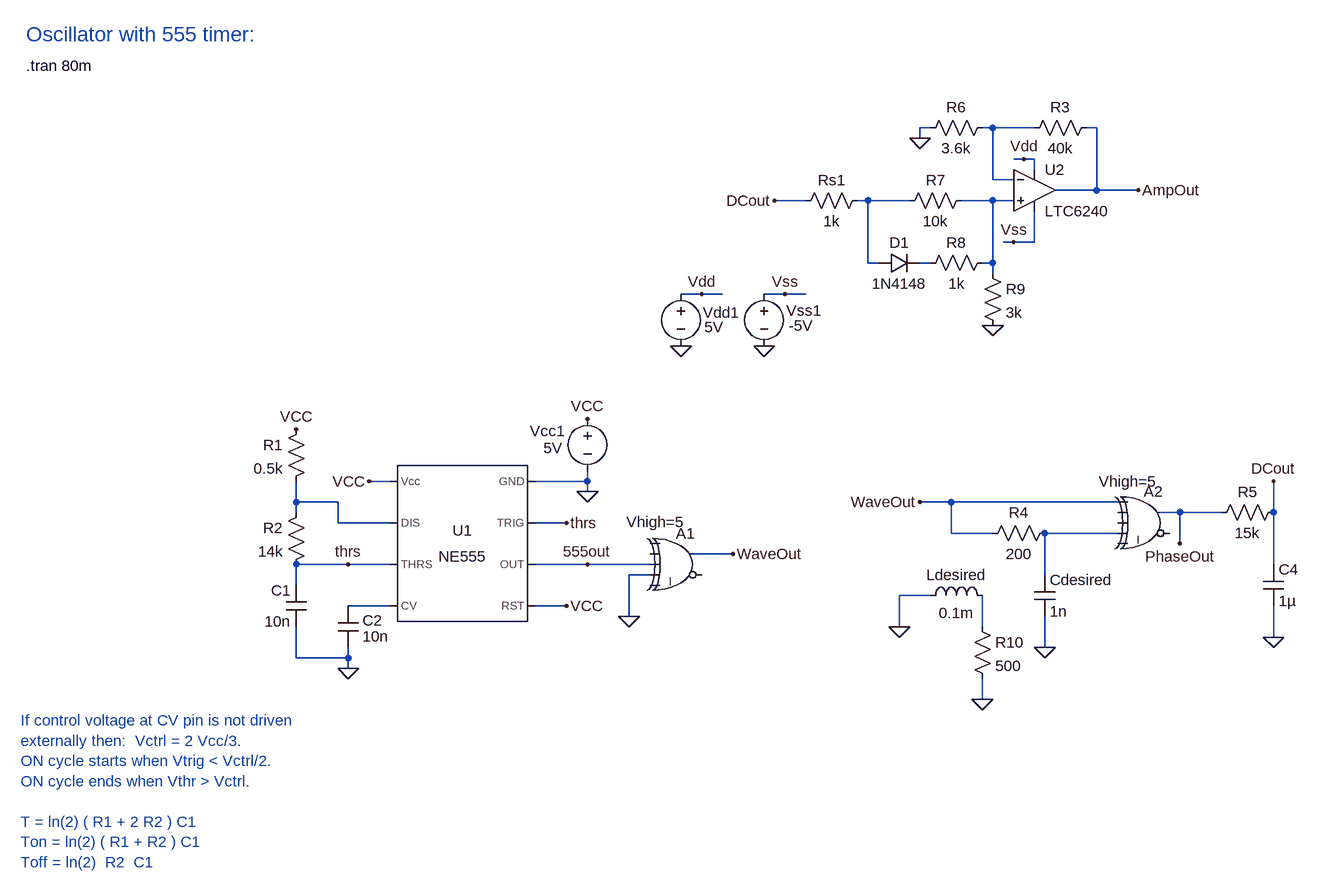
[diagram p0: schematic lcmeter_general.asc]
lcmeter_general.asc, the LTspice schematic file:
Version 4
SHEET 1 1228 680
WIRE 240 -720 224 -720
WIRE 336 -720 320 -720
WIRE 400 -720 336 -720
WIRE 496 -720 480 -720
WIRE 224 -704 224 -720
WIRE 384 -672 368 -672
WIRE 400 -672 384 -672
WIRE 400 -656 400 -672
WIRE 336 -640 336 -720
WIRE 368 -640 336 -640
WIRE 496 -624 496 -720
WIRE 496 -624 432 -624
WIRE 560 -624 496 -624
WIRE 48 -608 0 -608
WIRE 144 -608 128 -608
WIRE 208 -608 144 -608
WIRE 336 -608 288 -608
WIRE 368 -608 336 -608
WIRE 368 -544 352 -544
WIRE 400 -544 400 -592
WIRE 400 -544 368 -544
WIRE 144 -512 144 -608
WIRE 160 -512 144 -512
WIRE 240 -512 224 -512
WIRE 336 -512 336 -608
WIRE 336 -512 320 -512
WIRE 336 -496 336 -512
WIRE -112 -464 -144 -464
WIRE -80 -464 -112 -464
WIRE 16 -464 -16 -464
WIRE 48 -464 16 -464
WIRE -592 -176 -624 -176
WIRE -288 -176 -288 -192
WIRE -288 -176 -368 -176
WIRE -288 -160 -288 -176
WIRE -736 -144 -736 -176
WIRE -672 -144 -736 -144
WIRE 272 -144 224 -144
WIRE 528 -144 272 -144
WIRE -736 -128 -736 -144
WIRE 624 -128 592 -128
WIRE 688 -128 624 -128
WIRE 768 -128 768 -176
WIRE -672 -112 -672 -144
WIRE -592 -112 -672 -112
WIRE -320 -112 -368 -112
WIRE 272 -96 272 -144
WIRE 336 -96 272 -96
WIRE 528 -96 416 -96
WIRE 624 -80 624 -128
WIRE -64 -64 -128 -64
WIRE -656 -48 -736 -48
WIRE -592 -48 -656 -48
WIRE -288 -48 -368 -48
WIRE -192 -48 -288 -48
WIRE 768 -48 768 -128
WIRE -192 -32 -224 -32
WIRE 416 -32 416 -96
WIRE -736 -16 -736 -48
WIRE 240 0 192 0
WIRE -592 16 -656 16
WIRE -320 16 -368 16
WIRE -224 32 -224 -32
WIRE 192 48 192 0
WIRE 320 48 320 0
WIRE 768 64 768 16
WIRE 416 80 416 32
WIRE -736 96 -736 48
WIRE -656 96 -656 80
WIRE -656 96 -736 96
WIRE -656 112 -656 96
WIRE 320 160 320 128
FLAG -288 -160 0
FLAG -288 -48 555out
FLAG -656 112 0
FLAG -224 32 0
FLAG 416 80 0
FLAG 624 -80 PhaseOut
FLAG -288 -272 VCC
FLAG -320 16 VCC
FLAG -624 -176 VCC
FLAG -736 -256 VCC
FLAG -320 -112 thrs
FLAG -656 -48 thrs
FLAG 768 64 0
FLAG -64 -64 WaveOut
FLAG 224 -144 WaveOut
FLAG 768 -176 DCout
FLAG -144 -384 0
FLAG -112 -464 Vdd
FLAG 560 -624 AmpOut
FLAG 384 -672 Vdd
FLAG 336 -416 0
FLAG 224 -704 0
FLAG -16 -384 0
FLAG 16 -464 Vss
FLAG 368 -544 Vss
FLAG 0 -608 DCout
FLAG 320 160 0
FLAG 192 48 0
SYMBOL Misc\\NE555 -480 -80 M0
SYMATTR InstName U1
SYMBOL voltage -288 -288 M0
WINDOW 0 35 35 Left 2
WINDOW 3 38 61 Left 2
WINDOW 123 0 0 Left 2
WINDOW 39 0 0 Left 2
SYMATTR InstName Vcc1
SYMATTR Value 5V
SYMBOL cap -672 16 R0
WINDOW 0 38 22 Left 2
WINDOW 3 38 47 Left 2
SYMATTR InstName C2
SYMATTR Value 10n
SYMBOL Digital\\xor -144 -112 R0
WINDOW 3 -84 -1 Left 2
SYMATTR Value Vhigh=5
SYMATTR InstName A1
SYMATTR Value2 Vlow=0
SYMBOL res 432 -112 R90
WINDOW 0 0 56 VBottom 2
WINDOW 3 32 56 VTop 2
SYMATTR InstName R4
SYMATTR Value 200
SYMBOL cap 400 -32 R0
SYMATTR InstName Cdesired
SYMATTR Value 1n
SYMBOL Digital\\xor 576 -176 R0
WINDOW 3 -77 0 Left 2
SYMATTR Value Vhigh=5
SYMATTR InstName A2
SYMBOL res 784 -144 R90
WINDOW 0 0 56 VBottom 2
WINDOW 3 32 56 VTop 2
SYMATTR InstName R5
SYMATTR Value 15k
SYMBOL res -720 -272 M0
SYMATTR InstName R1
SYMATTR Value 0.5k
SYMBOL res -720 -144 M0
SYMATTR InstName R2
SYMATTR Value 14k
SYMBOL cap -720 -16 M0
SYMATTR InstName C1
SYMATTR Value 10n
SYMBOL cap 752 -48 R0
SYMATTR InstName C4
SYMATTR Value 1µ
SYMBOL voltage -144 -480 R0
WINDOW 0 34 44 Left 2
WINDOW 3 36 67 Left 2
WINDOW 123 0 0 Left 2
WINDOW 39 0 0 Left 2
SYMATTR InstName Vdd1
SYMATTR Value 5V
SYMBOL res 496 -736 R90
WINDOW 0 0 56 VBottom 2
WINDOW 3 32 56 VTop 2
SYMATTR InstName R3
SYMATTR Value 40k
SYMBOL res 336 -736 R90
WINDOW 0 0 56 VBottom 2
WINDOW 3 32 56 VTop 2
SYMATTR InstName R6
SYMATTR Value 3.6k
SYMBOL Opamps\\LTC6240 400 -624 R0
SYMATTR InstName U2
SYMBOL res 304 -624 R90
WINDOW 0 0 56 VBottom 2
WINDOW 3 32 56 VTop 2
SYMATTR InstName R7
SYMATTR Value 10k
SYMBOL res 336 -528 R90
WINDOW 0 0 56 VBottom 2
WINDOW 3 32 56 VTop 2
SYMATTR InstName R8
SYMATTR Value 1k
SYMBOL diode 160 -496 R270
WINDOW 0 32 32 VTop 2
WINDOW 3 0 32 VBottom 2
SYMATTR InstName D1
SYMATTR Value 1N4148
SYMBOL res 320 -512 R0
SYMATTR InstName R9
SYMATTR Value 3k
SYMBOL res 32 -592 R270
WINDOW 0 32 56 VTop 2
WINDOW 3 0 56 VBottom 2
SYMATTR InstName Rs1
SYMATTR Value 1k
SYMBOL voltage -16 -480 R0
WINDOW 0 34 41 Left 2
WINDOW 3 38 64 Left 2
WINDOW 123 0 0 Left 2
WINDOW 39 0 0 Left 2
SYMATTR InstName Vss1
SYMATTR Value -5V
SYMBOL ind 224 16 R270
WINDOW 0 32 56 VTop 2
WINDOW 3 5 56 VBottom 2
SYMATTR InstName Ldesired
SYMATTR Value 0.1m
SYMBOL res 304 32 R0
SYMATTR InstName R10
SYMATTR Value 500
TEXT -1152 -816 Left 2 !.tran 80m
TEXT -1160 192 Left 2 ;If control voltage at CV pin is not driven \nexternally then:  Vctrl = 2 Vcc/3.\nON cycle starts when Vtrig < Vctrl/2.\nON cycle ends when Vthr > Vctrl.\n \nT = ln(2) ( R1 + 2 R2 ) C1\nTon = ln(2) ( R1 + R2 ) C1\nToff = ln(2)  R2  C1
TEXT -1152 -864 Left 3 ;Oscillator with 555 timer:

The netlist it stands for:
* lcmeter_general.asc
XU1 0 thrs 555out VCC N007 thrs N005 VCC NE555  ; pins GND TRIG OUT RST CV THRS DIS Vcc
Vcc1 VCC 0 5V
C2 N007 0 10n
A1 0 0 555out 0 0 0 WaveOut 0 XOR Vhigh=5 Vlow=0
R4 N006 WaveOut 200
Cdesired N006 0 1n
A2 WaveOut 0 0 N006 0 0 PhaseOut 0 XOR Vhigh=5
R5 DCout PhaseOut 15k
R1 VCC N005 0.5k
R2 N005 thrs 14k
C1 thrs 0 10n
C4 DCout 0 1µ
Vdd1 Vdd 0 5V
R3 AmpOut N001 40k
R6 N001 0 3.6k
* U2: LTC6240 (symbol Opamps\LTC6240 not available, pins judged from their places): In+=N003 In-=N001 V+=Vdd V-=Vss OUT=AmpOut
R7 N003 N002 10k
R8 N003 N004 1k
D1 N002 N004 1N4148
R9 N003 0 3k
Rs1 DCout N002 1k
Vss1 Vss 0 -5V
Ldesired 0 N008 0.1m
R10 N008 0 500
.model D D
.lib standard.dio
.tran 80m
* If control voltage at CV pin is not driven
* externally then:  Vctrl = 2 Vcc/3.
* ON cycle starts when Vtrig < Vctrl/2.
* ON cycle ends when Vthr > Vctrl.
* T = ln(2) ( R1 + 2 R2 ) C1
* Ton = ln(2) ( R1 + R2 ) C1
* Toff = ln(2)  R2  C1
* Oscillator with 555 timer:
.lib NE555.sub
.backanno
.end